# Altium schematic sheet B38_TOUCH_KEYS.SchDoc
size A
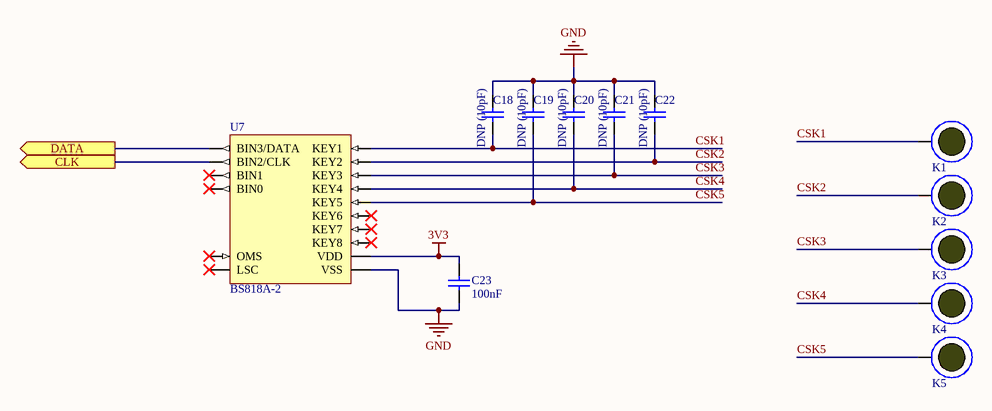
[diagram p0: B38_TOUCH_KEYS.SchDoc]

## Parts
C18  DNP (10pF)  [CAP0603]
C19  DNP (10pF)  [CAP0603]
C20  DNP (10pF)  [CAP0603]
C21  DNP (10pF)  [CAP0603]
C22  DNP (10pF)  [CAP0603]
C23  100nF  [CAP0603]
K1  (no value)  [PCBComponent_1]
K2  (no value)  [PCBComponent_1]
K3  (no value)  [PCBComponent_1]
K4  (no value)  [PCBComponent_1]
K5  (no value)  [PCBComponent_1]
U7  BS818A-2  [SO16]

## Ports
CLK (out), DATA (out)

## Nets
3V3: C23.1 U7.10(VDD)
GND: C18.1 C19.1 C20.1 C21.1 C22.1 C23.2 U7.9(VSS)
CLK: U7.15(BIN2/CLK) ; port CLK
CSK1: C18.2 K1.1 U7.1(KEY1)
CSK2: C22.2 K2.1 U7.2(KEY2)
CSK3: C21.2 K3.1 U7.3(KEY3)
CSK4: C20.2 K4.1 U7.4(KEY4)
CSK5: C19.2 K5.1 U7.5(KEY5)
DATA: U7.16(BIN3/DATA) ; port DATA

Not connected (* = marked no-connect by the designer): U7 6(KEY6)* 7(KEY7)* 8(KEY8)* 11(LSC)* 12(OMS)* 13(BIN0)* 14(BIN1)*

## Library data of the parts
C18-C22 = Cap: Capacitor 10V, 10%; Manufacturer: Walsin; PN: 0603B104K100CT; Value: 100nF
C23 = Cap: Capacitor 10V, 10%; Manufacturer: Walsin; PN: 0603B104K100CT; Value: 100nF
K1-K5 = TPAD
U7 = BS818A-2 : HOLTEK_Touch key input pin, Operating voltage: 2.2V~5.5V - 8 Key input - Serial output